# EAGLE design StewartPlatform (EAGLE 9.6.2)
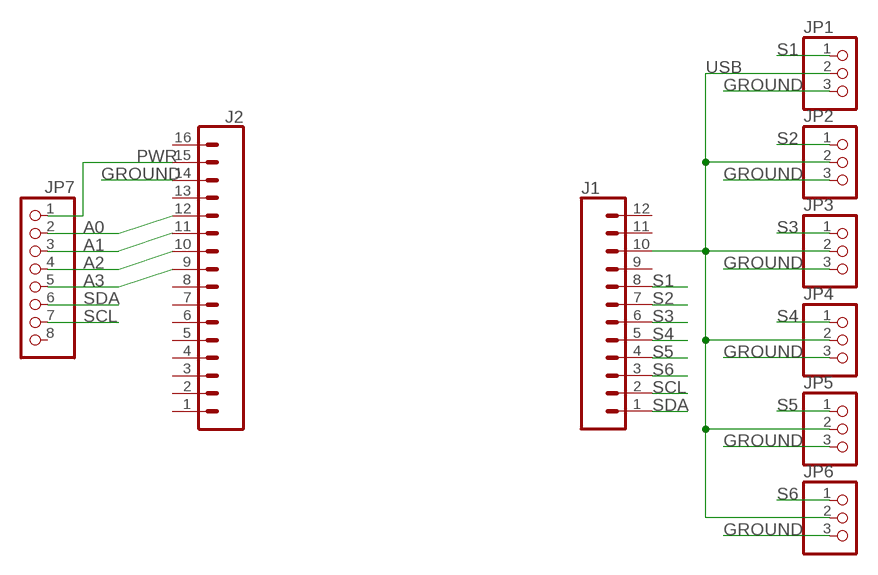
[diagram p0: schematic, sheet 1]

## Parts
J1  SPARKFUN-CONNECTORS_CONN_12  [SPARKFUN-CONNECTORS_1X12]
J2  SPARKFUN-CONNECTORS_CONN_16  [SPARKFUN-CONNECTORS_1X16]
JP1  RARNDT-MISCELANEOUS_PINHD-1X3  [RARNDT-MISCELANEOUS_1X03]
JP2  RARNDT-MISCELANEOUS_PINHD-1X3  [RARNDT-MISCELANEOUS_1X03]
JP3  RARNDT-MISCELANEOUS_PINHD-1X3  [RARNDT-MISCELANEOUS_1X03]
JP4  RARNDT-MISCELANEOUS_PINHD-1X3  [RARNDT-MISCELANEOUS_1X03]
JP5  RARNDT-MISCELANEOUS_PINHD-1X3  [RARNDT-MISCELANEOUS_1X03]
JP6  RARNDT-MISCELANEOUS_PINHD-1X3  [RARNDT-MISCELANEOUS_1X03]
JP7  PINHD-1X8  [1X08]

## Nets
A0: J2.12 JP7.2
A1: J2.11 JP7.3
A2: J2.10 JP7.4
A3: J2.9 JP7.5
GROUND: J2.14 JP1.3 JP2.3 JP3.3 JP4.3 JP5.3 JP6.3
PWR: J2.15 JP7.1
S1: J1.8 JP1.1
S2: J1.7 JP2.1
S3: J1.6 JP3.1
S4: J1.5 JP4.1
S5: J1.4 JP5.1
S6: J1.3 JP6.1
SCL: J1.2 JP7.7
SDA: J1.1 JP7.6
USB: J1.10 JP1.2 JP2.2 JP3.2 JP4.2 JP5.2 JP6.2
Unconnected: J1.9 J1.11 J1.12 J2.1 J2.2 J2.3 J2.4 J2.5 J2.6 J2.7 J2.8 J2.13 J2.16 JP7.8

## Library data of the parts
J1 = StewartPlatform:SPARKFUN-CONNECTORS_CONN_12: Multi connection point. Often used as Generic Header-pin footprint for 0.1 inch spaced/style header connections On any of the 0.1 inch spaced packages, you can populate with these: Break Away Headers - Straight <https://www.sparkfun.com/products/116> (PRT-00116) Break Away Male Headers - Right Angle <https://www.sparkfun.com/products/553> (PRT-00553) Female Headers <https://www.sparkfun.com/products/115> (PRT-00115) Break Away Headers - Machine Pin <https://www.sparkfun.com/products/117> (PRT-00117) Break Away Female Headers - Swiss Machine Pin <https://www.sparkfun.com/products/743> (PRT-00743) For SCREWTERMINALS and SPRING TERMINALS visit here: Screw Terimnals on SparkFun.com <https://www.sparkfun.com/search/results?term=Screw+Terminals> (5mm/3.5mm/2.54mm spacing) This device is also useful as a general connection point to wire up your design to another part of your project. Our various solder wires solder well into these plated through hole pads. Hook-Up Wire - Assortment (Stranded, 22 AWG) <https://www.sparkfun.com/products/11375> (PRT-11375) Hook-Up Wire - Assortment (Solid Core, 22 AWG) <https://www.sparkfun.com/products/11367> (PRT-11367) View the entire wire category on our website here <https://www.sparkfun.com/categories/141> Special notes: Molex polarized connector foot print use with SKU : PRT-08231 with associated crimp pins and housings. 1MM SMD Version SKU: PRT-10208 NOTES ON THE VARIANTS LOCK and LOCK_LONGPADS... This footprint was designed to help hold the alignment of a through-hole component (i.e. 6-pin header) while soldering it into place. You may notice that each hole has been shifted either up or down by 0.005 of an inch from it's more standard position (which is a perfectly straight line). This slight alteration caused the pins (the squares in the middle) to touch the edges of the holes. Because they are alternating, it causes a "brace" to hold the component in place. 0.005 has proven to be the perfect amount of "off-center" position when using our standard breakaway headers. Although looks a little odd when you look at the bare footprint, once you have a header in there, the alteration is very hard to notice. Also,if you push a header all the way into place, it is covered up entirely on the bottom side.
J2 = StewartPlatform:SPARKFUN-CONNECTORS_CONN_16: Multi connection point. Often used as Generic Header-pin footprint for 0.1 inch spaced/style header connections On any of the 0.1 inch spaced packages, you can populate with these: Break Away Headers - Straight <https://www.sparkfun.com/products/116> (PRT-00116) Break Away Male Headers - Right Angle <https://www.sparkfun.com/products/553> (PRT-00553) Female Headers <https://www.sparkfun.com/products/115> (PRT-00115) Break Away Headers - Machine Pin <https://www.sparkfun.com/products/117> (PRT-00117) Break Away Female Headers - Swiss Machine Pin <https://www.sparkfun.com/products/743> (PRT-00743) For SCREWTERMINALS and SPRING TERMINALS visit here: Screw Terimnals on SparkFun.com <https://www.sparkfun.com/search/results?term=Screw+Terminals> (5mm/3.5mm/2.54mm spacing) This device is also useful as a general connection point to wire up your design to another part of your project. Our various solder wires solder well into these plated through hole pads. Hook-Up Wire - Assortment (Stranded, 22 AWG) <https://www.sparkfun.com/products/11375> (PRT-11375) Hook-Up Wire - Assortment (Solid Core, 22 AWG) <https://www.sparkfun.com/products/11367> (PRT-11367) View the entire wire category on our website here <https://www.sparkfun.com/categories/141> Special notes: Molex polarized connector foot print use with SKU : PRT-08231 with associated crimp pins and housings. 1MM SMD Version SKU: PRT-10208 NOTES ON THE VARIANTS LOCK and LOCK_LONGPADS... This footprint was designed to help hold the alignment of a through-hole component (i.e. 6-pin header) while soldering it into place. You may notice that each hole has been shifted either up or down by 0.005 of an inch from it's more standard position (which is a perfectly straight line). This slight alteration caused the pins (the squares in the middle) to touch the edges of the holes. Because they are alternating, it causes a "brace" to hold the component in place. 0.005 has proven to be the perfect amount of "off-center" position when using our standard breakaway headers. Although looks a little odd when you look at the bare footprint, once you have a header in there, the alteration is very hard to notice. Also,if you push a header all the way into place, it is covered up entirely on the bottom side.
JP1-JP6 = StewartPlatform:RARNDT-MISCELANEOUS_PINHD-1X3: PIN HEADER
JP7 = pinhead:PINHD-1X8: PIN HEADER

## Board
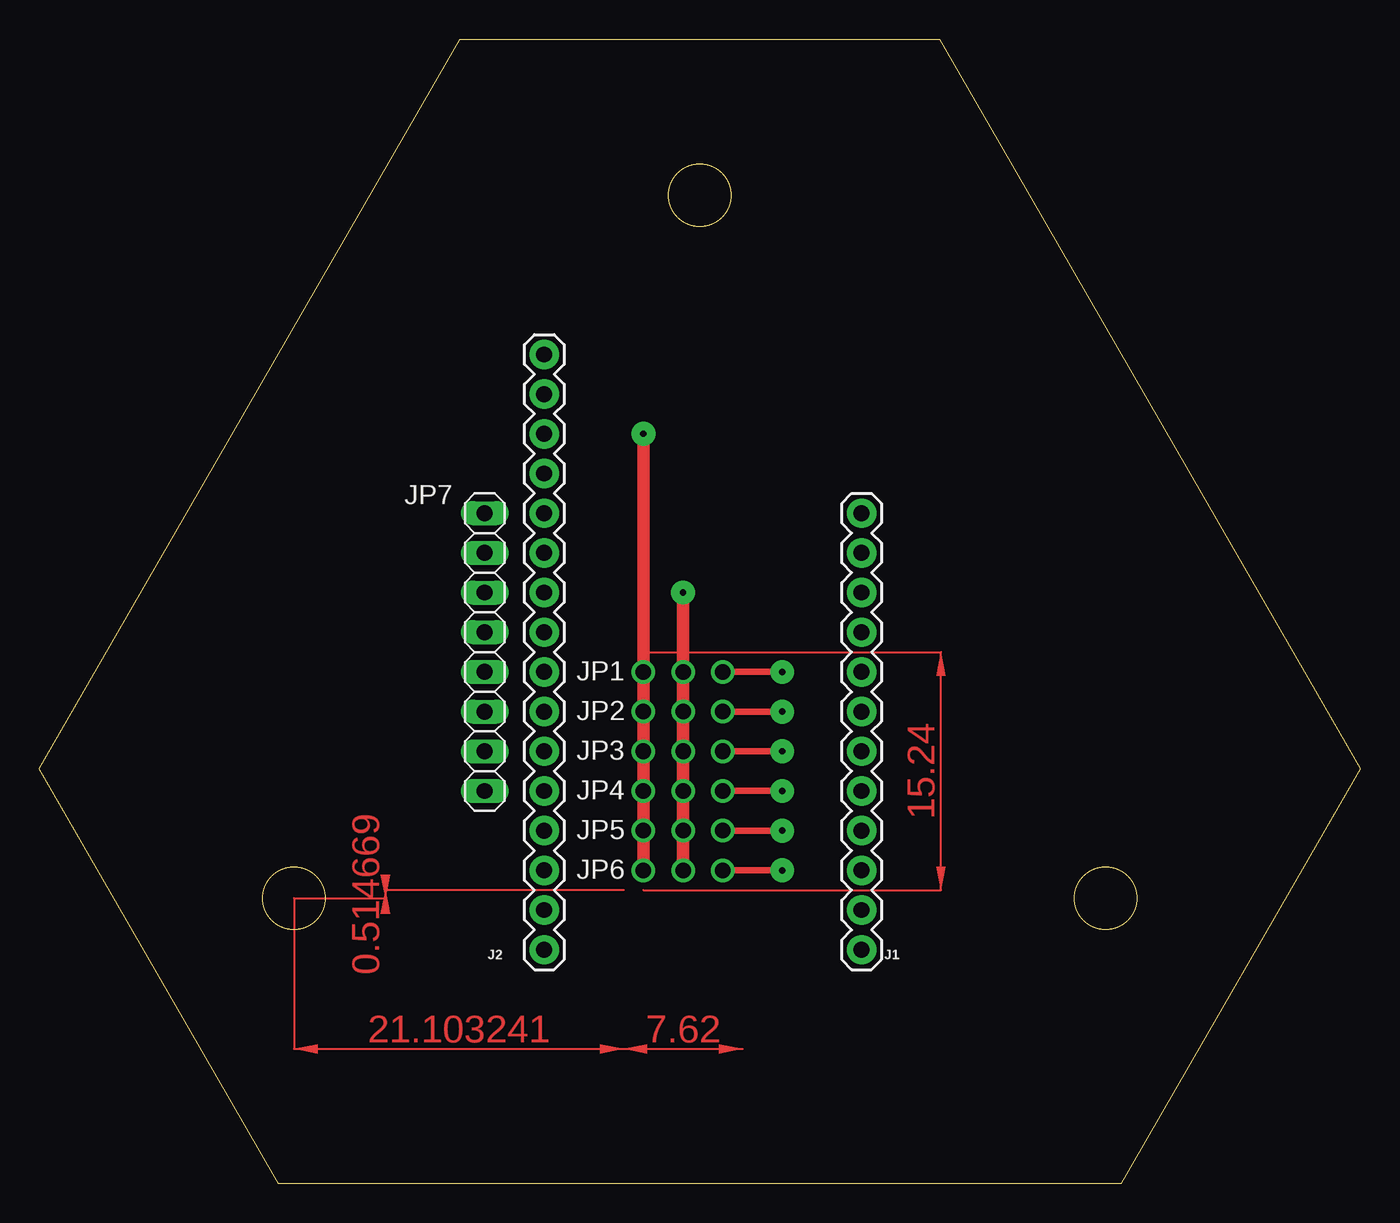
[diagram p1: board, top side]
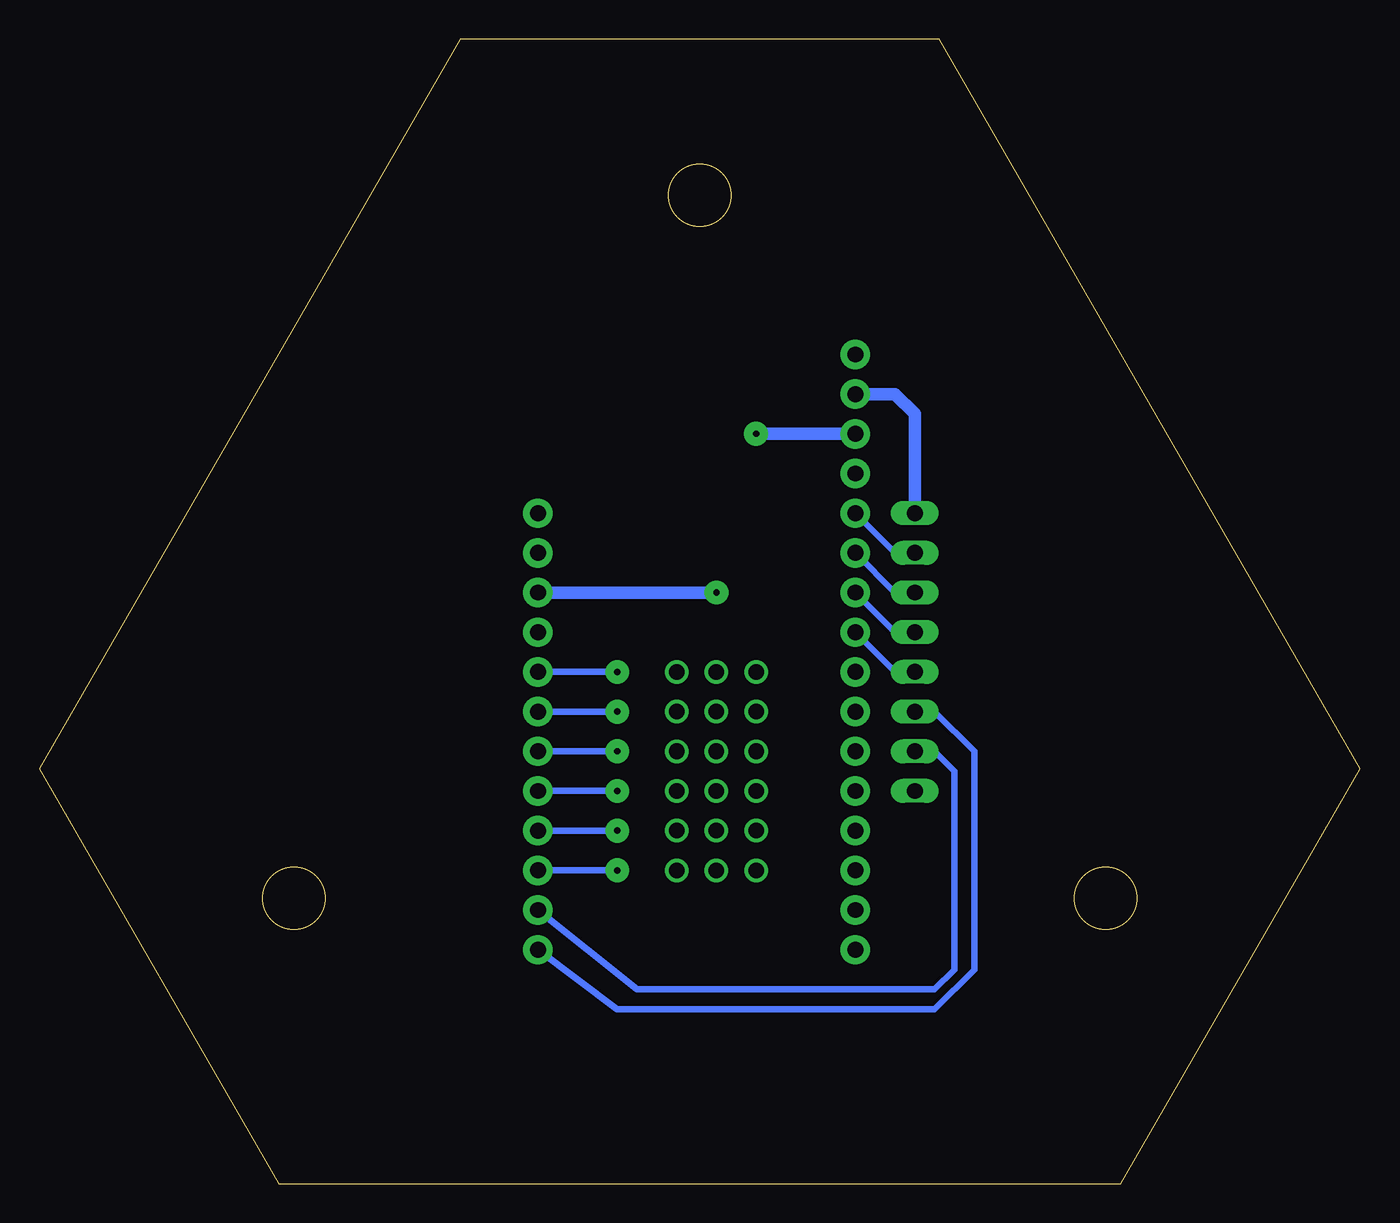
[diagram p2: board, bottom side, seen from below]

Size 84.61 x 73.27 mm. Coordinates in mm from the lower left corner, seen from the top.
Outline: 84.61,26.57 69.27,0 15.34,0 0,26.57 26.96,73.27 57.64,73.27 84.61,26.57
Outline: circle at 42.3,63.28 radius 2
Outline: circle at 68.28,18.28 radius 2
Outline: circle at 16.32,18.28 radius 2
Copper layers (1*16): Top 0.035mm / dielectric 1.5mm / Bottom 0.035mm
Design rules "default": minimum track width 6mil, minimum drill 0.35mm, track to track 6mil, track to pad 6mil, pad to pad 6mil, via to via 6mil, smd to smd 6mil, copper to edge 40mil, drill to drill 6mil, minimum pad ring 10mil, minimum via ring 8mil, stop-mask expansion 4mil, vias tented up to drill 0mil, thermal gap 10mil

### Footprints (pad centres in the part's own frame; a part is rotated, then mirrored left to right if it is on the bottom)
SPARKFUN-CONNECTORS_1X12 = drill 1.016 pad 1.88: 1 0,0; 2 2.54,0; 3 5.08,0; 4 7.62,0; 5 10.16,0; 6 12.7,0; 7 15.24,0; 8 17.78,0; 9 20.32,0; 10 22.86,0; 11 25.4,0; 12 27.94,0
SPARKFUN-CONNECTORS_1X16 = drill 1.016 pad 1.88: 1 0,0; 2 2.54,0; 3 5.08,0; 4 7.62,0; 5 10.16,0; 6 12.7,0; 7 15.24,0; 8 17.78,0; 9 20.32,0; 10 22.86,0; 11 25.4,0; 12 27.94,0; 13 30.48,0; 14 33.02,0; 15 35.56,0; 16 38.1,0
RARNDT-MISCELANEOUS_1X03 = drill 1: 1 -2.54,0; 2 0,0; 3 2.54,0
1X08 = drill 1.016 long: 1 -8.89,0; 2 -6.35,0; 3 -3.81,0; 4 -1.27,0; 5 1.27,0; 6 3.81,0; 7 6.35,0; 8 8.89,0

### Placement (x,y rotation side)
J1  52.67,14.98 90 top
J2  32.35,14.98 90 top
JP1  41.24,32.76 180 top
JP2  41.24,30.22 180 top
JP3  41.24,27.68 180 top
JP4  41.24,25.14 180 top
JP5  41.24,22.6 180 top
JP6  41.24,20.06 180 top
JP7  28.54,34.03 270 top

### Tracks (layer width: path | path; a pad name or v marks a point on that pad's centre or on a via)
A0
  Bottom 0.406: JP7.2 29.81,40.38 J2.12
A1
  Bottom 0.406: JP7.3 29.81,37.84 J2.11
A2
  Bottom 0.406: JP7.4 29.81,35.3 J2.10
A3
  Bottom 0.406: JP7.5 29.81,32.76 J2.9
GROUND  (via drill 0.41 pad 1.52)
  Top 0.813: JP6.3 JP5.3 JP4.3 JP3.3 JP2.3 JP1.3 v38.7,48
  Bottom 0.813: v38.7,48 J2.14
PWR
  Bottom 0.813: JP7.1 28.54,49.27 29.81,50.54 J2.15
S1  (via drill 0.41 pad 1.52)
  Top 0.406: JP1.1 v47.59,32.76
  Bottom 0.406: v47.59,32.76 J1.8
S2  (via drill 0.41 pad 1.52)
  Top 0.406: v47.59,30.22 JP2.1
  Bottom 0.406: J1.7 v47.59,30.22
S3  (via drill 0.41 pad 1.52)
  Top 0.406: JP3.1 v47.59,27.68
  Bottom 0.406: v47.59,27.68 J1.6
S4  (via drill 0.41 pad 1.52)
  Top 0.406: v47.59,25.14 JP4.1
  Bottom 0.406: J1.5 v47.59,25.14
S5  (via drill 0.41 pad 1.52)
  Top 0.406: JP5.1 v47.59,22.6
  Bottom 0.406: v47.59,22.6 J1.4
S6  (via drill 0.41 pad 1.52)
  Top 0.406: v47.59,20.06 JP6.1
  Bottom 0.406: J1.3 v47.59,20.06
SCL
  Bottom 0.406: JP7.7 27.27,27.68 26,26.41 26,13.71 27.27,12.44 46.32,12.44 J1.2
SDA
  Bottom 0.406: JP7.6 27.27,30.22 24.73,27.68 24.73,13.71 27.27,11.17 47.59,11.17 J1.1
USB  (via drill 0.41 pad 1.52)
  Top 0.813: v41.24,37.84 JP1.2 JP2.2 JP3.2 JP4.2 JP5.2 JP6.2
  Bottom 0.813: v41.24,37.84 J1.10
(copper drawn outside any net)
  shapes: Top area x4